# Altium schematic sheet 16V_VBatt_External.SchDoc
size A4; SheetNumber: 4
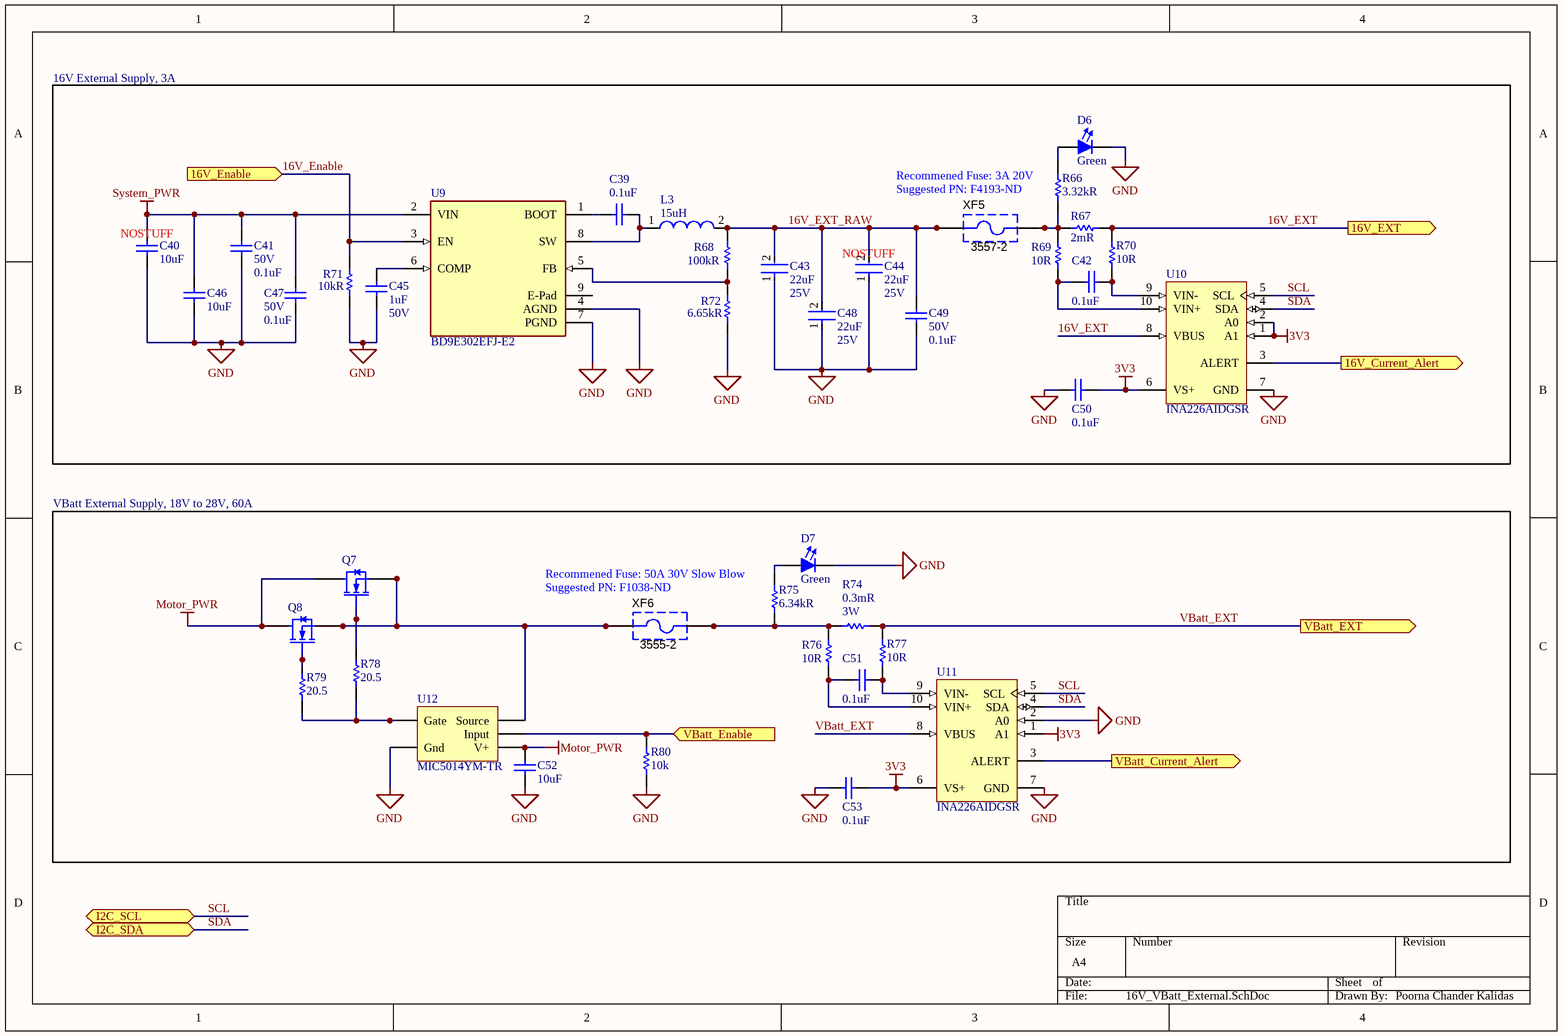
[diagram p0: 16V_VBatt_External.SchDoc]

## Parts
C39  Capacitance: 0.1uF  [FP-CL10-0_1-IPC_A]  (hidden comment: CL10B104JB8NNNC)
C40  Capacitance: 10uF  [CAPC3216X180X50ML20T30]  (hidden comment: CL31B106KBHNNNE)
C41  Voltage: 50V  Capacitance: 0.1uF  [FP-CL10-0_1-IPC_A]  (hidden comment: CL10B104JB8NNNC)
C42  Capacitance: 0.1uF  [FP-CL10-0_1-IPC_A]  (hidden comment: CL10B104JB8NNNC)
C43  Capacitance: 22uF  Voltage: 25V  [FP-GRM32-IPC_A]  (hidden comment: GRM32ER71E226ME15K)
C44  Capacitance: 22uF  Voltage: 25V  [FP-GRM32-IPC_A]  (hidden comment: GRM32ER71E226ME15K)
C45  Capacitance: 1uF  Voltage: 50V  [0803 CAP]  (hidden comment: CL21B105KBFNNNG)
C46  Capacitance: 10uF  [CAPC3216X180X50ML20T30]  (hidden comment: CL31B106KBHNNNE)
C47  Voltage: 50V  Capacitance: 0.1uF  [FP-CL10-0_1-IPC_A]  (hidden comment: CL10B104JB8NNNC)
C48  Capacitance: 22uF  Voltage: 25V  [FP-GRM32-IPC_A]  (hidden comment: GRM32ER71E226ME15K)
C49  Voltage: 50V  Capacitance: 0.1uF  [FP-CL10-0_1-IPC_A]  (hidden comment: CL10B104JB8NNNC)
C50  Capacitance: 0.1uF  [FP-CL10-0_1-IPC_A]  (hidden comment: CL10B104JB8NNNC)
C51  Capacitance: 0.1uF  [FP-CL10-0_1-IPC_A]  (hidden comment: CL10B104JB8NNNC)
C52  Capacitance: 10uF  [CAPC3216X180X50ML20T30]  (hidden comment: CL31B106KBHNNNE)
C53  Capacitance: 0.1uF  [FP-CL10-0_1-IPC_A]  (hidden comment: CL10B104JB8NNNC)
D6  Color: Green  [FP-LB_Q39E-MFG]  (hidden comment: LT Q39G-Q1OO-25-1)
D7  Color: Green  [FP-LB_Q39E-MFG]  (hidden comment: LT Q39G-Q1OO-25-1)
L3  Inductance: 15uH  [WE-PD-XXL]  (hidden comment: 7447709150)
Q7  MOSFET N-Channel, 40V, 100A, 272W  [LFPAK-PowerSO8]  (value not drawn)
Q8  MOSFET N-Channel, 40V, 100A, 272W  [LFPAK-PowerSO8]  (value not drawn)
R66  Resistance: 3.32kR  [RESC1608X55X30ML15T15]  (hidden comment: ERJ-3EKF3321V)
R67  Resistance: 2mR  [RESC2716X08N]  (hidden comment: CSR1206-0R002F1)
R68  Resistance: 100kR  [RESC1609X50X30ML10T20]  (hidden comment: CRCW0603-100KFKEA)
R69  Resistance: 10R  [FP-ERJ3EK-IPC_A]  (hidden comment: ERJ3EKF10R0V)
R70  Resistance: 10R  [FP-ERJ3EK-IPC_A]  (hidden comment: ERJ3EKF10R0V)
R71  Resistance: 10kR  [RESC1608X55X25ML10T15]  (hidden comment: RC0603FR-0710KL)
R72  Resistance: 6.65kR  [RESC0603(1608)_M]  (hidden comment: RC0603FR-076K65L)
R74  Resistance: 0.3mR  Max Power Dissipation: 3W  [RESC6332N(2512")]  (hidden comment: HCS2512FTL300)
R75  Resistance: 6.34kR  [RESC1609X50X30ML10T20]  (hidden comment: CRCW06036K34FKEA)
R76  Resistance: 10R  [FP-ERJ3EK-IPC_A]  (hidden comment: ERJ3EKF10R0V)
R77  Resistance: 10R  [FP-ERJ3EK-IPC_A]  (hidden comment: ERJ3EKF10R0V)
R78  value 20.5  [RESC1608N(0603")]  (hidden comment: 20.5 Ohm, 1%, 1/10W , 0603, SMD)
R79  value 20.5  [RESC1608N(0603")]  (hidden comment: 20.5 Ohm, 1%, 1/10W , 0603, SMD)
R80  value 10k  [RESC1608N(0603")]  (hidden comment: 10kR, 1%, 1/10W, 0603 SMD)
U9  BD9E302EFJ-E2  [FP-HTSOP-J8-IPC_A]
U10  INA226AIDGSR  [DGS0010A_M]
U11  INA226AIDGSR  [DGS0010A_M]
U12  MIC5014YM-TR  [SOC 8]
XF5  3557-2  [KSTN-3557-2]
XF6  3555-2  [3555-2-Footprint-1]

## Blocks framed on the sheet
VBatt External Supply, 18V to 28V, 60A: C51-C53 D7 Q7 Q8 R74-R80 U11 U12 XF6

## Ports
16V_Current_Alert (out), 16V_Enable (in), 16V_EXT (out), I2C_SCL (bidir), I2C_SDA (bidir), VBatt_Current_Alert (out), VBatt_Enable (in), VBatt_EXT (out)

## Nets
3V3: C50.1 C53.1 U10.1(A1) U10.2(A0) U10.6(VS+) U11.1(A1) U11.6(VS+)
GND: C40.2 C41.1 C43.1 C44.1 C45.1 C46.2 C47.1 C48.1 C49.1 C50.2 C52.2 C53.2 D6.1(Cathode) D7.1(Cathode) R71.1 R72.1 R80.2 U9.4(AGND) U9.7(PGND) U10.7(GND) U11.2(A0) U11.7(GND) U12.4(Gnd)
Motor_PWR: C52.1 Q7.5(Drain) Q8.5(Drain) U12.1(V+)
System_PWR: C40.1 C41.2 C46.1 C47.2 U9.2(VIN)
16V_Current_Alert: U10.3(ALERT) ; port 16V_Current_Alert
16V_Enable: R71.2 U9.3(EN) ; port 16V_Enable
16V_EXT: R67.1 R70.1 U10.8(VBUS) ; port 16V_EXT
16V_EXT_RAW: C43.2 C44.2 C48.2 C49.2 L3.2 R68.2 XF5.1 XF5.2
SCL: U10.5(SCL) U11.5(SCL) ; port I2C_SCL
SDA: U10.4(SDA) U11.4(SDA) ; port I2C_SDA
VBatt_Current_Alert: U11.3(ALERT) ; port VBatt_Current_Alert
VBatt_Enable: R80.1 U12.2(Input) ; port VBatt_Enable
VBatt_EXT: R74.1 R77.1 U11.8(VBUS) ; port VBatt_EXT
NetC39_1: C39.1 U9.1(BOOT)
NetC39_2: C39.2 L3.1 U9.8(SW)
NetC42_1: C42.1 R70.2 U10.9(VIN-)
NetC42_2: C42.2 R69.2 U10.10(VIN+)
NetC45_2: C45.2 U9.6(COMP)
NetC51_1: C51.1 R77.2 U11.9(VIN-)
NetC51_2: C51.2 R76.2 U11.10(VIN+)
NetD6_2: D6.2(Anode) R66.1
NetD7_2: D7.2(Anode) R75.2
NetQ7_1: Q7.1(Source) Q7.2(Source) Q7.3(Source) Q8.1(Source) Q8.2(Source) Q8.3(Source) U12.3(Source) XF6.1 XF6.2
NetQ7_4: Q7.4(Gate) R78.1
NetQ8_4: Q8.4(Gate) R79.1
NetR66_2: R66.2 R67.2 R69.1 XF5.3 XF5.4
NetR68_1: R68.1 R72.2 U9.5(FB)
NetR74_2: R74.2 R75.1 R76.1 XF6.3 XF6.4
NetR78_2: R78.2 R79.2 U12.5(Gate)

Not connected (* = marked no-connect by the designer): U9 9(E-Pad)

## Notes on the sheet
- 16V External Supply, 3A
- (near C40) NOSTUFF
- (near R66) Recommened Fuse: 3A 20V
  Suggested PN: F4193-ND
- (near C44) NOSTUFF
- Recommened Fuse: 50A 30V Slow Blow
  Suggested PN: F1038-ND
- Poorna Chander Kalidas

## Library data of the parts
C39 C41 C42 C47 C49-C51 C53 = CMP-00000-4: CAP CER 0.1UF 50V X7R 0603; Tolerance: 5%; Material: Ceramic; Case Code (Imperial): 0603; Mount: Surface Mount; Thickness: 0.035inch; Depth: 0.8mm; Packaging: Tape and Reel; Package Quantity: 1; Dielectric: X7R; Height: 0.8mm; Radiation Hardening: No; Max Operating Temperature: 125°C; Voltage Rating: 50V; Case/Package: 0603; Min Operating Temperature: -55°C; Case Code (Metric): 1608; Length: 1.6mm; Contact Plating: Tin; Width: 0.031inch
  C39 C42 C50 C51 C53: Voltage: 50V
C40 C46 C52 = CMP-00004-2: Cap Ceramic 10uF 50V X7R 10% Pad SMD 1206 125°C T/R; Thickness: 0.071inch; Case/Package: 1206; Case Code (Metric): 3216; Case Code (Imperial): 1206; Voltage Rating: 50V; Length: 0.126inch; Max Operating Temperature: 125°C; Voltage Rating (DC): 50V; Dielectric: X7R; Lead Free: Lead Free; Min Operating Temperature: -55°C; Tolerance: 10%; Mount: Surface Mount; Packaging: Tape and Reel; Width: 0.063inch
C43 C44 C48 = CMP-00040-2: CAP CER 22UF 25V X7R 1210; Tolerance: 20%; Case/Package: 1210; Packaging: Tape and Reel; Mount: Surface Mount; Composition: Ceramic; Height: 2.5mm; Voltage Rating: 25V; Width: 0.098inch; Case Code (Imperial): 1210; Length: 0.126inch; Case Code (Metric): 3225; Voltage Rating (DC): 25V; Dielectric: X7R; Thickness: 0.106inch; Weight: 0.00388oz; Package Quantity: 4000; Max Operating Temperature: 125°C; Min Operating Temperature: -55°C; Termination: SMD/SMT
C45 = CMP-00005-3: SAMSUNG ELECTRO-MECHANICS - CL21B105KBFNNNG - MLCC CAPACITORS; Tolerance: 10%; Material: Ceramic; Dielectric: X7R; Case/Package: 0805; Voltage Rating: 50V; Contact Plating: Tin; Max Operating Temperature: 125°C; Termination: Wraparound; Package Quantity: 3000; Depth: 1.25mm; Mount: Surface Mount; Min Operating Temperature: -55°C; Thickness: 0.053inch; Packaging: Tape and Reel; Case Code (Metric): 2012; Length: 2mm; Case Code (Imperial): 0805; Width: 0.049inch
D6 D7 = CMP-00064-3: LED GREEN DIFFUSED 0603 SMD; Dominant Wavelength: 530nm; Luminous Intensity: 280mcd; Lens Style: Diffused,Colorless,Rectangular; Number of LEDs: 1; Forward Voltage: 2.85V; Test Current: 5mA; Reverse Voltage: 5V; Forward Current: 15mA; Luminous Flux: 0.55lm; Radiation Hardening: No; Packaging: Tape and Reel; Mount: Surface Mount; Max Operating Temperature: 85°C; Number of Elements: 1; Number of Pins: 2; Min Operating Temperature: -40°C; Depth: 0.9mm; Case/Package: SMD/SMT; Length: 1.7mm
L3 = CMP-00041-1: WURTH ELEKTRONIK - 7447709150 - Power Inductor (SMD), 15 µH, 6.5 A, Shielded, 8 A, WE-PD Series, 12mm x 12mm x 10mm; RMS Current (Irms): 6.5A; DC Resistance (DCR): 26mR; Saturation Current: 8A; Test Frequency: 1kHz; Core Material: Ferrite; Self Resonant Frequency: 17MHz; Tolerance: 20%; Height - Seated (Max): 0.394inch; Composition: Wirewound; Width: 12mm; Length: 12mm; Max DC Current: 6.5A; Weight: 0.02lb; Case Code (Metric): 3225; Number of Pins: 2; Packaging: Cut Tape; Lead Free: Lead Free; Case/Package: Nonstandard; Case Code (Imperial): 1210; Min Operating Temperature: -40°C; Series Resistance: 26mR; Resistance: 26mR; Lead Pitch: 7mm; Height: 10mm; Depth: 12mm; Mount: Surface Mount; Package Quantity: 250; Max Operating Temperature: 125°C; REACH SVHC: Unknown; Current Rating: 6.5A; Shielding: Shielded; Termination: SMD/SMT; Inductance Tolerance: 20%
Q7 Q8 = CMP-052-0019-1: MOSFET N-Channel, 40V, 100A, 272W, Enh-Mode; MFG#: PSMN1R8-40YLC,115; MFG: NXP Semiconductors; Reviewed_By: Ashwin Sira; Latest_Revision_Note: Attached footprint; Publisher: AUVic; Design Item ID: MOSFET N-Channel, 40V, 100A, 272W; Created By: Ashwin Sira; Component Type: Standard; Latest_Revision_Date: 2016_04_26; Source: AUVic_Schematic_Library_Transistors.SchLib; Latest_Revision_By: Ashwin Sira; Reviewed_Date: 2016_04_26; Pin Count: 5
R66 = CMP-00075-2: RES SMD 3.32K OHM 1% 1/10W 0603; Power Rating: 100mW; Voltage Rating (DC): 50V; Temperature Coefficient: 100ppm/°C; Voltage Rating: 75V; Military Standard: Not; Lead Free: Lead Free; Case/Package: 0603; Number of Terminations: 2; Min Operating Temperature: -55°C; Case Code (Metric): 1608; Mount: Surface Mount; Case Code (Imperial): 0603; REACH SVHC: No SVHC; Termination: SMD/SMT; Depth: 0.8mm; Max Power Dissipation: 100mW; Contact Plating: Tin; Max Operating Temperature: 155°C; Width: 0.031inch; Features: Automotive AEC-Q200; Packaging: Tape and Reel; Composition: Thick Film; Length: 1.6mm; Height: 0.45mm; Tolerance: 1%; Package Quantity: 5000; Radiation Hardening: No
R67 = CMP-00031-1: RES 0.002 OHM 1W 1% 1206; Temperature Coefficient: 50ppm/°C; Number of Terminations: 2; Composition: Metal Element; Case Code (Metric): 3216; Min Operating Temperature: -55°C; Length: 0.126inch; Tolerance: 1%; Packaging: Tape and Reel; Max Power Dissipation: 1W; Width: 0.063inch; Package Quantity: 1; Max Operating Temperature: 170°C; Height: 0.024inch; Case/Package: 1206; Case Code (Imperial): 1206
R68 = CMP-00036-2: Resistor; Thick Film; 100 Kilohms; 0.1 W; 1%; SMT; 0603; TCR 37 ppm/DegC; Tape and Reel; Voltage Rating: 75V; Temperature Coefficient: 100ppm/°C; Power Rating: 100mW; Number of Terminations: 2; Number of Pins: 2; Contact Plating: Tin,Lead; Lead Free: Lead Free; Voltage Rating (DC): 75V; Package Quantity: 10; REACH SVHC: Unknown; Min Operating Temperature: -55°C; Height: 0.45mm; Composition: Thick Film; Case Code (Metric): 1608; Weight: 7.1E-05oz; Depth: 0.85mm; Features: Automotive AEC-Q200; Military Standard: Not; Tolerance: 1%; Radiation Hardening: No; Max Power Dissipation: 100mW; Case Code (Imperial): 0603; Max Operating Temperature: 155°C; Packaging: Tape and Reel; Width: 0.033inch; Case/Package: 0603; Termination: SMD/SMT; Length: 1.55mm
R69 R70 R76 R77 = CMP-00034-3: PANASONIC - ERJ3EKF10R0V - SMD Chip Resistor, 0603 [1608 Metric], 10 ohm, ERJ3EK Series, 75 V, Thick Film, 100 mW; Temperature Coefficient: 100ppm/°C; Tolerance: 1%; Max Power Dissipation: 100mW; Voltage Rating (DC): 75V; Package Quantity: 5000; Case Code (Imperial): 0603; Military Standard: Not; Depth: 0.8mm; Number of Terminations: 2; Working Voltage: 75V; Min Operating Temperature: -55°C; Width: 0.8mm; Composition: Thick Film; Packaging: Tape and Reel; Power Rating: 100mW; REACH SVHC: No SVHC; Max Operating Temperature: 155°C; Case Code (Metric): 1608; Features: Automotive AEC-Q200; Case/Package: 0603; Length: 1.6mm; Number of Pins: 2; Lead Free: Lead Free; Height: 0.45mm; Voltage Rating: 75V; Contact Plating: Tin; Termination: SMD/SMT; Mount: Surface Mount; Radiation Hardening: No
R71 = CMP-00037-2: Res General Purpose Thick Film 0603 10K Ohm 1% 1/10W ±100ppm/°C Molded SMD Paper T/R; Power Rating: 100mW; Voltage Rating (DC): 50V; Voltage Rating: 75V; Case/Package: 0603; Weight: 7.1E-05oz; Case Code (Imperial): 0603; Composition: Thick Film; Depth: 0.8mm; Min Operating Temperature: -55°C; Width: 0.8mm; Height: 0.45mm; Military Standard: Not; Packaging: Tape and Reel; Termination: SMD/SMT; Lead Free: Lead Free; Temperature Coefficient: 100ppm/°C; Number of Pins: 2; Max Operating Temperature: 155°C; Lead Pitch: 0.3mm; REACH SVHC: No SVHC; Case Code (Metric): 1608; Tolerance: 1%; Length: 1.6mm
R72 = CMP-00039-2: RES SMD 6.65K OHM 1% 1/10W 0603; Temperature Coefficient: 100ppm/°C; Voltage Rating: 50V; Max Power Dissipation: 100mW; Width: 0.031inch; Termination: SMD/SMT; Max Operating Temperature: 155°C; Tolerance: 1%; Lead Free: Lead Free; Package Quantity: 1; Case/Package: 0603; Number of Terminations: 2; Length: 1.6mm; Depth: 0.8mm; Height: 0.022inch; Min Operating Temperature: -55°C; Case Code (Metric): 1608; Power Rating: 100mW; Features: Moisture Resistant; Composition: Thick Film; Military Standard: Not; Voltage Rating (DC): 50V; Packaging: Tape and Reel; Case Code (Imperial): 0603
R74 = CMP-047-0000-2: 300 µOhms ±1% 3W Chip Resistor 2512 (6432 Metric) Automotive AEC-Q200, Current Sense, Moisture Resistant Metal Element; Temperature Coefficient: 150ppm/°C; Features: Moisture Resistant,Automotive AEC-Q200; Max Operating Temperature: 170°C; Length: 0.256inch; Tolerance: 1%; Case Code (Imperial): 2512; Case Code (Metric): 6432; Min Operating Temperature: -55°C; Number of Terminations: 2; Height: 0.038inch; Packaging: Cut Tape; Case/Package: 2512; Width: 0.128inch; Package Quantity: 4000; Composition: Metal Element
R75 = CMP-00072-2: VISHAY         CRCW06036K34FKEA.             SMD Chip Resistor, Thick Film, 6.34 kohm, 75 V, 0603 [1608 Metric], 100 mW,  1%, CRCW Series; Voltage Rating: 75V; Power Rating: 100mW; Temperature Coefficient: 100ppm/°C; Depth: 0.85mm; Military Standard: Not; Composition: Thick Film; Case Code (Metric): 1608; Case/Package: 0603; Packaging: Tape and Reel; Max Operating Temperature: 155°C; Tolerance: 1%; Height: 0.45mm; Package Quantity: 10; Case Code (Imperial): 0603; Width: 0.033inch; Length: 1.55mm; REACH SVHC: Unknown; Termination: SMD/SMT; Radiation Hardening: No; Contact Plating: Tin; Weight: 7.1E-05oz; Number of Pins: 2; Min Operating Temperature: -55°C; Features: Automotive AEC-Q200; Number of Terminations: 2; Max Power Dissipation: 100mW
R78 R79 = CMP-047-0030-1: Date Created: 2017-06-23; Source: AUVic_Schematic_Library_Resistors.SchLib; Pin Count: 2; Publisher: AUVic; Design Item ID: 20.5 Ohm, 1%, 1/10W , 0603, SMD; Created By: Gabriel Green; Component Type: Standard
R80 = CMP-047-0013-1: Owned By: AUVic; Made By: Ashwin Sira; Design Item ID: 10kR, 1%, 1/10W, 0603 SMD; Pin Count: 2; Component Type: Standard; Created On: 14-05-31; Last Edited: 14-05-31; Source: AUVic_Schematic_Library_Resistors.SchLib
U9 = CMP-08938-000005-1: IC REG BUCK ADJ 3A 8HTSOP-J; Output Type: Adjustable; Switching Frequency: 550kHz; Max Output Voltage: 19.6V; Min Input Voltage: 7V; Synchronous Rectifier: Yes; Min Output Voltage: 1V; Output Configuration: Positive; Max Input Voltage: 28V; Number of Outputs: 1; Packaging: Cut Tape; Mount: Surface Mount; Max Operating Temperature: 85°C; Min Operating Temperature: -40°C; Output Current: 3A
U10 U11 = CMP-00032-1: Bi Directional Current and Power Monitor 10-Pin VSSOP T/R; Nominal Supply Current: 330uA; Common Mode Rejection Ratio: 140dB; Output Current: 10mA; Accuracy: 0.02%; Input Bias Current: 10uA; Input Offset Voltage (Vos): 2.5uV; Min Supply Voltage: 2.7V; Max Supply Voltage: 5.5V; Mount: Surface Mount; Case/Package: VSSOP; Contact Plating: Gold; Radiation Hardening: No; Packaging: Tape and Reel; Package Quantity: 1; Max Operating Temperature: 125°C; Lead Free: Lead Free; Number of Pins: 10; Min Operating Temperature: -40°C; REACH SVHC: No SVHC
U12 = CMP-028-0000-2: High-Side or Low-Side Gate Driver IC Non-Inverting 8-SOIC; Number of Drivers: 1; Turn-On Delay Time: 8ms; Min Supply Voltage: 2.75V; Max Supply Voltage: 30V; Turn-Off Delay Time: 30us; Channel Type: Single; Max Output Current: 10mA; Lead Free: Lead Free; Max Operating Temperature: 85°C; Number of Pins: 8; Min Operating Temperature: -40°C; Height: 1.48mm; Mount: Surface Mount; Package Quantity: 2500; Case/Package: SOIC; Packaging: Tape and Reel; Number of Outputs: 1; Width: 3.94mm; Length: 4.93mm
XF5 = CMP-00030-4: Fuse Holder; Auto; 2 in1 Blade; THM; 1 Fuse; Vertical; 30 Amps; Current Rating: 20A; Voltage Rating (AC): 500V; Number of Poles: 1; Illumination Type: Illuminated; Fuse Type: Automotive; REACH SVHC: No SVHC; Lead Free: Lead Free; Max Operating Temperature: 145°C; Fuse Current: 20A; Min Operating Temperature: -50°C; Voltage: 500V; Contact Material: Brass; Orientation: Vertical; Package Quantity: 1; Depth: 6.8mm; Flammability Rating: UL94 V-0; Color: Black; Contact Plating: Tin; Termination: PC Pin; Material: Brass,Tin,Nylon; Number of Circuits: 1; Mount: Vertical,PCB; Length: 19.8mm
XF6 = CMP-00058-1: FUSE HOLDER MAXI AUTO BLADE PC; Approvals: UL; Number of Circuits: 1; Fuse Type: Automotive; Current Rating: 40A; Voltage Rating (AC): 500V; Illumination Type: Illuminated; Body Material: Nylon,Glass; Length: 35.8mm; Min Operating Temperature: -50°C; Color: Black; Orientation: Vertical; Package Quantity: 100; Number of Poles: 1; Contact Plating: Nickel; Material: Copper,Brass,Tin,Nylon; Max Operating Temperature: 145°C; Voltage: 500V; Lead Free: Lead Free; Termination: PC Pin; Mount: Vertical,PCB; Fuse Current: 40A; Contact Material: Copper,Tin; REACH SVHC: No SVHC; Depth: 5.9mm